# Altium schematic sheet mada7.SchDoc
size A4
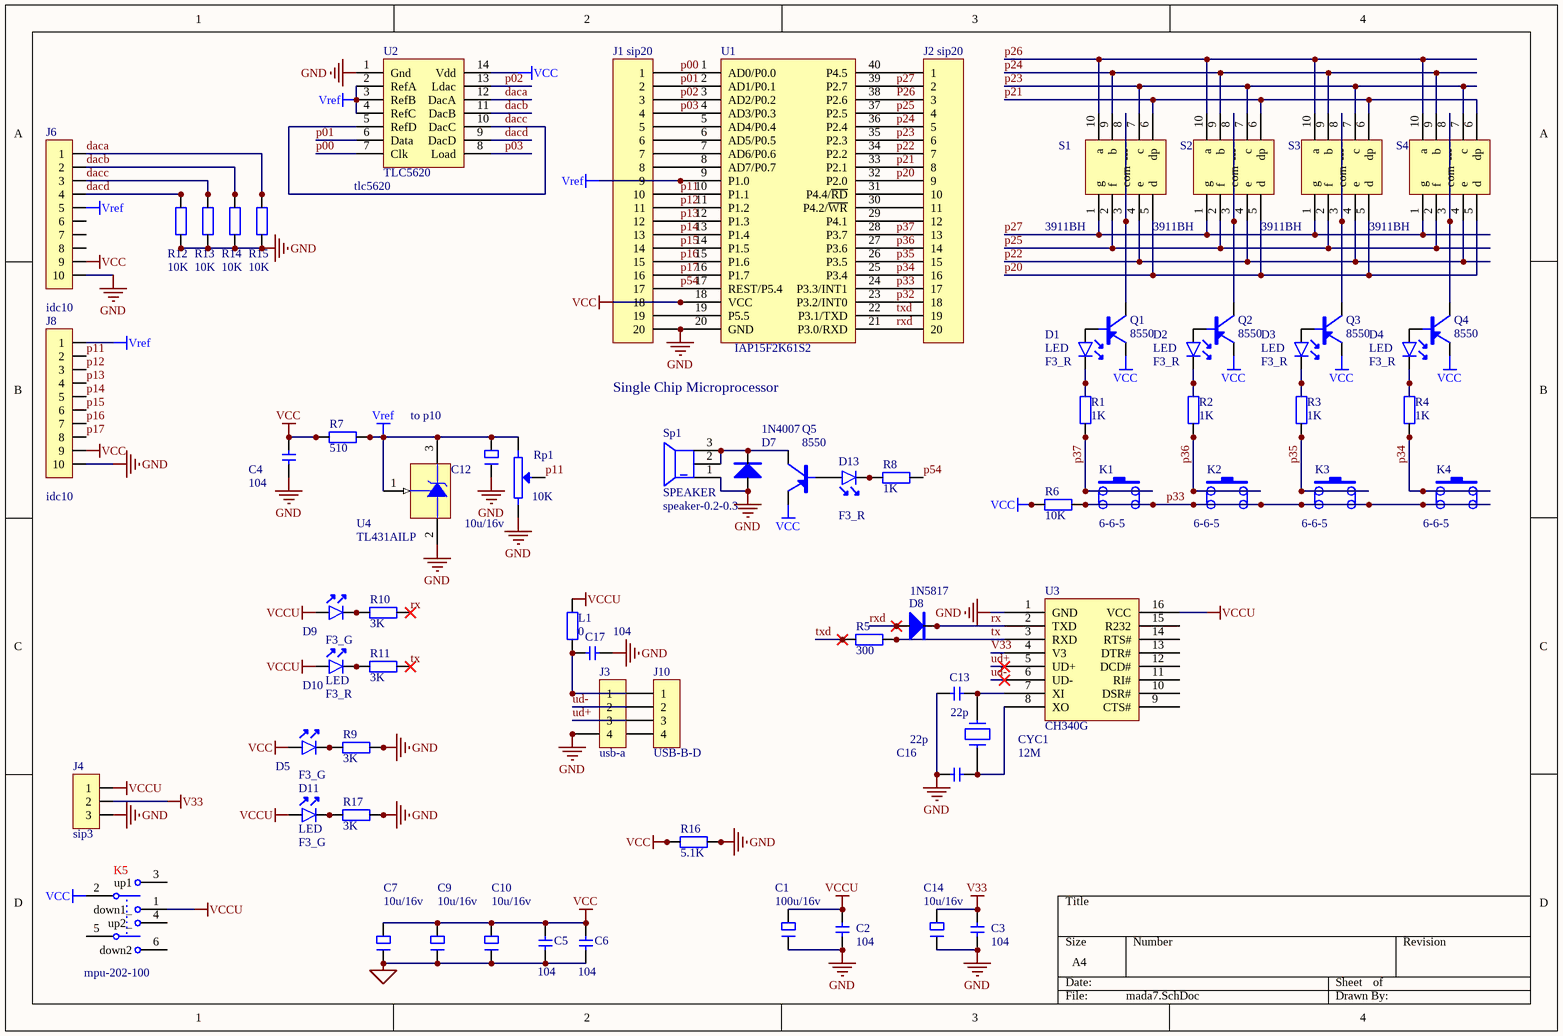
[diagram p0: mada7.SchDoc]

## Parts
C1  100u/16v  [rb.1/.2]
C2  value 104  [cap010805]  (hidden comment: CAP)
C3  value 104  [cap010805]  (hidden comment: 103)
C4  104  [cap010805]
C5  104  [cap010805]
C6  104  [cap010805]
C7  10u/16v  [rb.1/.2]
C9  value 10u/16v  [rb.1/.2]  (hidden comment: 100u/16v)
C10  10u/16v  [rb.1/.2]
C12  value 10u/16v  [rb.1/.2]  (hidden comment: 10u)
C13  value 22p  [cap010805]  (hidden comment: 104)
C14  10u/16v  [rb.1/.2]
C16  value 22p  [cap010805]
C17  104  [cap010805]
CYC1  value 12M  [cyc-rad]  (hidden comment: 12Mhz)
D1  LED  value F3_R  [led-3]
D2  LED  value F3_R  [led-3]
D3  LED  value F3_R  [led-3]
D4  LED  value F3_R  [led-3]
D5  value F3_G  [led30805]  (hidden comment: LED)
D7  value 1N4007  [smc03]  (hidden comment: sma03)
D8  value 1N5817  [smc03]  (hidden comment: sma03)
D9  value F3_G  [led30805]  (hidden comment: LED)
D10  LED  value F3_R  [led30805]
D11  LED  value F3_G  [led30805]
D13  value F3_R  [led30805]  (hidden comment: LED)
J1  value sip20  [HDR1X20]  (hidden comment: Header 20)
J2  value sip20  [HDR1X20]  (hidden comment: Header 20)
J3  USB-a  [usb-a]
J4  value sip3  [SIP3]  (hidden comment: Header 20)
J6  value idc10  [idc10]  (hidden comment: CON10)
J8  value idc10  [idc10]  (hidden comment: CON10)
J10  value USB-B-D  [USB_b]
K1  6-6-5  [pb1]
K2  6-6-5  [pb1]
K3  6-6-5  [pb1]
K4  6-6-5  [pb1]
K5  value mpu-202-100  [DPDT-6]  (hidden comment: SW-DPDT)
L1  value 0  [axial0.3]  (hidden comment: Res2)
Q1  8550  [to-92a]
Q2  8550  [to-92a]
Q3  8550  [to-92a]
Q4  8550  [to-92a]
Q5  8550  [to-92a]
R1  value 1K  [a030805]  (hidden comment: Res22)
R2  value 1K  [a030805]  (hidden comment: Res22)
R3  value 1K  [a030805]  (hidden comment: Res22)
R4  value 1K  [a030805]  (hidden comment: Res22)
R5  value 300  [a030805]  (hidden comment: Res22)
R6  value 10K  [a030805]  (hidden comment: Res22)
R7  value 510  [a030805]  (hidden comment: Res22)
R8  value 1K  [a030805]  (hidden comment: Res22)
R9  value 3K  [a030805]  (hidden comment: Res22)
R10  value 3K  [a030805]  (hidden comment: Res22)
R11  value 3K  [a030805]  (hidden comment: Res22)
R12  value 10K  [a030805]  (hidden comment: Res22)
R13  value 10K  [a030805]  (hidden comment: Res22)
R14  value 10K  [a030805]  (hidden comment: Res22)
R15  value 10K  [a030805]  (hidden comment: Res22)
R16  value 5.1K  [a030805]  (hidden comment: Res22)
R17  value 3K  [a030805]  (hidden comment: Res22)
Rp1  10k  [VR3296-1]
S1  3911BH  [LED10s]
S2  3911BH  [LED10s]
S3  3911BH  [LED10s]
S4  3911BH  [LED10s]
Sp1  SPEAKER  value speaker-0.2-0.3  [sp0.23]
U1  value IAP15F2K61S2  [DIP40]  (hidden comment: 单片机IAP15F2K61S2)
U2  TLC5620  [dip14]
U3  CH340G  [SOP-16]
U4  TL431AILP  [BCY-W3/B.8]

## Nets
GND: C1.1 C2.2 C3.2 C4.2 C5.2 C6.2 C7.1 C9.1 C10.1 C12.1 C13.2 C14.1 C16.2 C17.2 D7.2 D7.4 J1.20 J3.4 J4.3 J6.10 J8.10 J10.4 R9.1 R9.3 R12.1 R12.3 R13.1 R13.3 R14.1 R14.3 R15.1 R15.3 R16.2 R16.4 R17.1 R17.3 Rp1.3 Sp1.1 U1.20(GND) U2.1(Gnd) U3.1(GND) U4.2(A)
V33: C3.1 C14.2 J4.2 U3.4(V3)
VCC: C4.1 C5.1 C6.1 C7.2 C9.2 C10.2 D5.1 J1.18 J6.9 J8.9 K5.2(com1) Q1.1(E) Q2.1(E) Q3.1(E) Q4.1(E) Q5.1(E) R6.2 R6.4 R7.2 R7.4 R16.1 R16.3 U1.18(VCC) U2.14(Vdd)
VCCU: C1.2 C2.1 D9.1 D10.1 D11.1 J4.1 K5.1(down1_) L1.2 U3.16(VCC)
Vref: C12.2 J1.9 J6.5 J8.1 R7.1 R7.3 Rp1.1 U1.9(P1.0) U2.2(RefA) U2.3(RefB) U2.4(RefC) U4.1(REF) U4.3(K)
daca: J6.1 R15.2 R15.4 U2.12(DacA)
dacb: J6.2 R14.2 R14.4 U2.11(DacB)
dacc: J6.3 R13.2 R13.4 U2.5(RefD) U2.10(DacC)
dacd: J6.4 R12.2 R12.4 U2.9(DacD)
p00: J1.1 U1.1(AD0/P0.0) U2.7(Clk)
p01: J1.2 U1.2(AD1/P0.1) U2.6(Data)
p02: J1.3 U1.3(AD2/P0.2) U2.13(Ldac)
p03: J1.4 U1.4(AD3/P0.3) U2.8(Load)
p11: J1.10 J8.2 Rp1.2 U1.10(P1.1)
p12: J1.11 J8.3 U1.11(P1.2)
p13: J1.12 J8.4 U1.12(P1.3)
p14: J1.13 J8.5 U1.13(P1.4)
p15: J1.14 J8.6 U1.14(P1.5)
p16: J1.15 J8.7 U1.15(P1.6)
p17: J1.16 J8.8 U1.16(P1.7)
p20: J2.9 S1.5(d) S2.5(d) S3.5(d) S4.5(d) U1.32(P2.0)
p21: J2.8 S1.6(dp) S2.6(dp) S3.6(dp) S4.6(dp) U1.33(P2.1)
p22: J2.7 S1.4(e) S2.4(e) S3.4(e) S4.4(e) U1.34(P2.2)
p23: J2.6 S1.7(c) S2.7(c) S3.7(c) S4.7(c) U1.35(P2.3)
p24: J2.5 S1.9(b) S2.9(b) S3.9(b) S4.9(b) U1.36(P2.4)
p25: J2.4 S1.2(f) S2.2(f) S3.2(f) S4.2(f) U1.37(P2.5)
p26: J2.3 S1.10(a) S2.10(a) S3.10(a) S4.10(a) U1.38(P2.6)
p27: J2.2 S1.1(g) S2.1(g) S3.1(g) S4.1(g) U1.39(P2.7)
p32: J2.18 U1.23(P3.2/INT0)
p33: J2.17 K1.2 K1.3 K2.2 K2.3 K3.2 K3.3 K4.2 K4.3 R6.1 R6.3 U1.24(P3.3/INT1)
p34: J2.16 K4.1 K4.4 R4.1 R4.3 U1.25(P3.4)
p35: J2.15 K3.1 K3.4 R3.1 R3.3 U1.26(P3.5)
p36: J2.14 K2.1 K2.4 R2.1 R2.3 U1.27(P3.6)
p37: J2.13 K1.1 K1.4 R1.1 R1.3 U1.28(P3.7)
p54: J1.17 R8.2 R8.4 U1.17(REST/P5.4)
rx: D8.1 D8.3 R10.1 R10.3 U3.2(TXD)
rxd: D8.2 D8.4 J2.20 U1.21(P3.0/RXD)
tx: R5.1 R5.3 R11.1 R11.3 U3.3(RXD)
txd: J2.19 R5.2 R5.4 U1.22(P3.1/TXD)
ud+: J3.3 J10.3 U3.5(UD+)
ud-: J3.2 J10.2 U3.6(UD-)
NetC13_1: C13.1 CYC1.2 U3.7(XI)
NetC16_1: C16.1 CYC1.1 U3.8(XO)
NetC17_1: C17.1 J3.1 J10.1 L1.1
NetD1_1: D1.1 Q1.2(B)
NetD1_2: D1.2 R1.2 R1.4
NetD2_1: D2.1 Q2.2(B)
NetD2_2: D2.2 R2.2 R2.4
NetD3_1: D3.1 Q3.2(B)
NetD3_2: D3.2 R3.2 R3.4
NetD4_1: D4.1 Q4.2(B)
NetD4_2: D4.2 R4.2 R4.4
NetD5_2: D5.2 R9.2 R9.4
NetD7_1: D7.1 D7.3 Q5.3(C) Sp1.2 Sp1.3
NetD9_2: D9.2 R10.2 R10.4
NetD10_2: D10.2 R11.2 R11.4
NetD11_2: D11.2 R17.2 R17.4
NetD13_1: D13.1 Q5.2(B)
NetD13_2: D13.2 R8.1 R8.3
NetJ1_5: J1.5 U1.5(AD4/P0.4)
NetJ1_6: J1.6 U1.6(AD5/P0.5)
NetJ1_7: J1.7 U1.7(AD6/P0.6)
NetJ1_8: J1.8 U1.8(AD7/P0.7)
NetJ1_19: J1.19 U1.19(P5.5)
NetJ2_1: J2.1 U1.40(P4.5)
NetJ2_10: J2.10 U1.31(P4.4/~{RD})
NetJ2_11: J2.11 U1.30(P4.2/~{WR})
NetJ2_12: J2.12 U1.29(P4.1)
NetQ1_3: Q1.3(C) S1.3(com) S1.8(---)
NetQ2_3: Q2.3(C) S2.3(com) S2.8(---)
NetQ3_3: Q3.3(C) S3.3(com) S3.8(---)
NetQ4_3: Q4.3(C) S4.3(com) S4.8(---)

Not connected (* = marked no-connect by the designer): J6 6 7 8; K5 3(up1) 4(up2_) 5(com2) 6(down2); U3 9(CTS#) 10(DSR#) 11(RI#) 12(DCD#) 13(DTR#) 14(RTS#) 15(R232)

## Notes on the sheet
- to p10
- Single Chip Microprocessor
- Labels drawn without touching a wire or pin: VCC

## Library data of the parts
C1 C7 C9 C10 C12 C14 = ELECTRO1: Electrolytic Capacitor
  C1: Value: 100u/16v
  C7 C10 C14: Value: 10u/16v
C2 C4-C6 C17 = CAP: Capacitor
  C5 C6 C17: Value: 104
C3 = CAP: Capacitor; Value: 104
C13 C16 = CAP
CYC1 = CRYSTAL
J1 J2 = Header 20: Header, 20-Pin; LatestRevisionDate: 17-Jul-2002; LatestRevisionNote: Re-released for DXP Platform.; Publisher: Altium Limited
J3 J10 = CON4: Connector
  J3: Value: usb-a
J4 = CON3: Connector
J6 J8 = CON10: Connector
K1-K4 = SW-PB2
  K1: Value: 6-6-5
  K2-K4: value: 6-6-5
K5 = SW-DPDT: Double-Pole, Double-Throw Switch; Published: 24-Mar-1999; LatestRevisionDate: 17-Jul-2002; LatestRevisionNote: Re-released for DXP Platform.; PackageReference: DPDT-6; Publisher: Altium Limited
L1 = Res2: Resistor; Published: 8-Jun-2000; LatestRevisionDate: 17-Jul-2002; LatestRevisionNote: Re-released for DXP Platform.; PackageReference: AXIAL-0.4; Publisher: Altium Limited
Q1-Q5 = PNP: Value: 8550
R1-R17 = Res22: Resistor; Published: 8-Jun-2000; LatestRevisionDate: 17-Jul-2002; LatestRevisionNote: Re-released for DXP Platform.; PackageReference: AXIAL-0.4; Publisher: Altium Limited
Rp1 = POT2: Value: 10K
S1-S4 = DS1: Value: 3911BH
Sp1 = SPEAKER: SPEAKER sip0.2/0.3
U1 = Component_3
U4 = TL431AILP: Programmable Precision Reference; Published: 15-Apr-2002; DatasheetVersion: 1999; PackageVersion: 1996; PackageReference: 29-04; Publisher: Altium Limited; PackageDescription: TO, Flat Index; 3 In-Line, Axial Leads; Body Dia. 4.8mm; Leads 0.48 x 0.51 mm (max); ComponentLink1Description: Manufacturer Link; ComponentLink1URL: http://www.onsemi.com/site/products/taxonomy/0,4438,503,00.html; ComponentLink2Description: Datasheet; ComponentLink2URL: http://www.onsemi.com/pub/Collateral/TL431-D.PDF
U2 = TLC5620: Value: tlc5620